# Altium schematic sheet LED_Board.SchDoc
size B
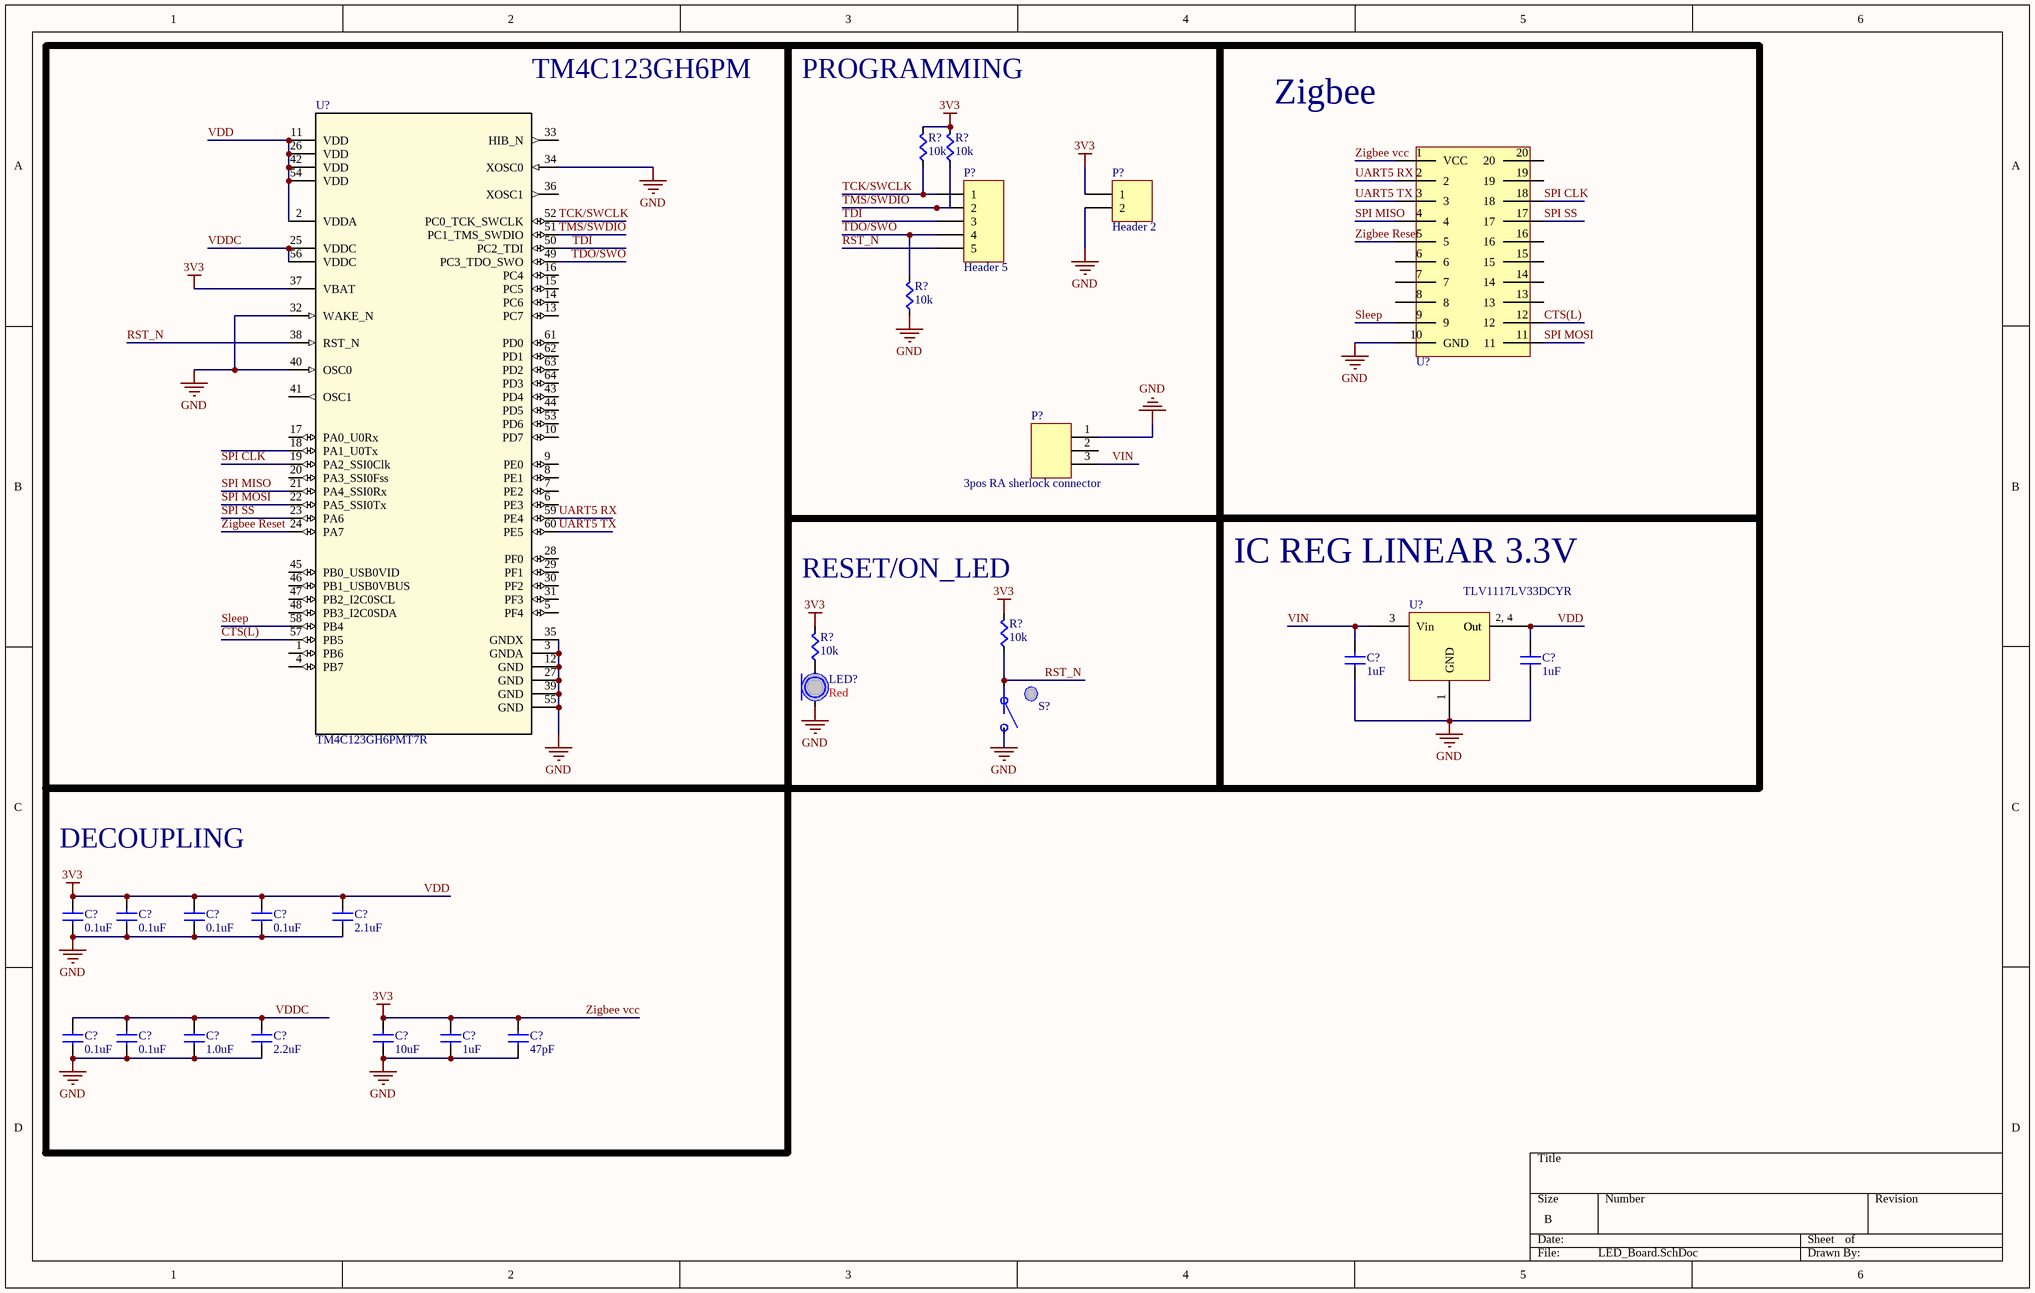
[diagram p0: LED_Board.SchDoc]

## Parts
(Parts that share a designator on the sheet are numbered #1, #2 ... from top to bottom, then left to right.)
C?#1  value 1uF  [CAPC0603]  (hidden comment: Cap)
C?#2  value 1uF  [CAPC0603]  (hidden comment: Cap)
C?#3  value 0.1uF  [CAPC0603]  (hidden comment: Cap)
C?#4  value 0.1uF  [CAPC0603]  (hidden comment: Cap)
C?#5  value 0.1uF  [CAPC0603]  (hidden comment: Cap)
C?#6  value 0.1uF  [CAPC0603]  (hidden comment: Cap)
C?#7  value 2.1uF  [CAPC0603]  (hidden comment: Cap)
C?#8  value 0.1uF  [CAPC0603]  (hidden comment: Cap)
C?#9  value 0.1uF  [CAPC0603]  (hidden comment: Cap)
C?#10  value 1.0uF  [CAPC0603]  (hidden comment: Cap)
C?#11  value 2.2uF  [CAPC0603]  (hidden comment: Cap)
C?#12  value 10uF  [CAPC0603]  (hidden comment: Cap)
C?#13  value 1uF  [CAPC0603]  (hidden comment: Cap)
C?#14  value 47pF  [CAPC0603]  (hidden comment: Cap)
LED?  Color: Red  [LED0603]  (hidden comment: LED)
P?#1  Header 5  [HDR1X5]
P?#2  Header 2  [HDR1X2]
P?#3  3pos RA sherlock connector  [MOLEX-HDR-1X3-SHERLOCK-RA]
R?#1  value 10k  [RES0603]  (hidden comment: Res)
R?#2  value 10k  [RES0603]  (hidden comment: Res)
R?#3  value 10k  [RES0603]  (hidden comment: Res)
R?#4  value 10k  [RES0603]  (hidden comment: Res)
R?#5  value 10k  [RES0603]  (hidden comment: Res)
S?  Button  [PTS645xxxxSMTR92]  (value not drawn)
U?#1  XBee  [XBee]  (value not drawn)
U?#2  TM4C123GH6PMT7R  [PM0064A_N]
U?#3  TLV1117LV33DCYR  [SOT23-4N]

## Blocks framed on the sheet
TM4C123GH6PM: U?#2
Zigbee: U?#1
IC REG LINEAR 3.3V: C?#1 C?#2 U?#3
DECOUPLING: C?#3-C?#14

## Nets
GND: C?#1.2(B) C?#2.2(B) C?#3.2(B) C?#4.2(B) C?#5.2(B) C?#6.2(B) C?#7.2(B) C?#8.2(B) C?#9.2(B) C?#10.2(B) C?#11.2(B) C?#12.2(B) C?#13.2(B) C?#14.2(B) LED?.C P?#2.2 P?#3.1 R?#3.2(B) S?.B U?#1.10(GND) U?#2.3(GNDA) U?#2.12(GND) U?#2.27(GND) U?#2.32(WAKE_N) U?#2.34(XOSC0) U?#2.35(GNDX) U?#2.39(GND) U?#2.40(OSC0) U?#2.55(GND) U?#3.1(GND)
VDD: C?#2.1(A) C?#3.1(A) C?#4.1(A) C?#5.1(A) C?#6.1(A) C?#7.1(A) C?#12.1(A) C?#13.1(A) C?#14.1(A) P?#2.1 R?#1.1(A) R?#2.1(A) R?#4.1(A) R?#5.1(A) U?#1.1(VCC) U?#2.2(VDDA) U?#2.11(VDD) U?#2.26(VDD) U?#2.37(VBAT) U?#2.42(VDD) U?#2.54(VDD) U?#3.2(Out) U?#3.4(Out)  [also labelled 3V3, Zigbee vcc]
CTS(L): U?#1.12 U?#2.57(PB5)
RST_N: P?#1.5 R?#4.2(B) S?.A U?#2.38(RST_N)
Sleep: U?#1.9 U?#2.58(PB4)
SPI CLK: U?#1.18 U?#2.19(PA2_SSI0Clk)
SPI MISO: U?#1.4 U?#2.21(PA4_SSI0Rx)
SPI MOSI: U?#1.11 U?#2.22(PA5_SSI0Tx)
SPI SS: U?#1.17 U?#2.23(PA6)
TCK/SWCLK: P?#1.1 R?#1.2(B) U?#2.52(PC0_TCK_SWCLK)
TDI: P?#1.3 U?#2.50(PC2_TDI)
TDO/SWO: P?#1.4 R?#3.1(A) U?#2.49(PC3_TDO_SWO)
TMS/SWDIO: P?#1.2 R?#2.2(B) U?#2.51(PC1_TMS_SWDIO)
UART5 RX: U?#1.2 U?#2.59(PE4)
UART5 TX: U?#1.3 U?#2.60(PE5)
VDDC: C?#8.1(A) C?#9.1(A) C?#10.1(A) C?#11.1(A) U?#2.25(VDDC) U?#2.56(VDDC)
VIN: C?#1.1(A) P?#3.3 U?#3.3(Vin)
Zigbee Reset: U?#1.5 U?#2.24(PA7)
NetLED?_A: LED?.A R?#5.2(B)

Not connected (* = marked no-connect by the designer): P?#3 2; U?#1 6 7 8 13 14 15 16 19 20; U?#2 1(PB6) 4(PB7) 5(PF4) 6(PE3) 7(PE2) 8(PE1) 9(PE0) 10(PD7) 13(PC7) 14(PC6) 15(PC5) 16(PC4) 17(PA0_U0Rx) 18(PA1_U0Tx) 20(PA3_SSI0Fss) 28(PF0) 29(PF1) 30(PF2) 31(PF3) 33(HIB_N) 36(XOSC1) 41(OSC1) 43(PD4) 44(PD5) 45(PB0_USB0VID) 46(PB1_USB0VBUS) 47(PB2_I2C0SCL) 48(PB3_I2C0SDA) 53(PD6) 61(PD0) 62(PD1) 63(PD2) 64(PD3)

## Notes on the sheet
- (near R?#1) PROGRAMMING
- (near R?#4) RESET/ON_LED
- (in symbol TLV1117LV33DCYR) 2, 4

## Library data of the parts
C?#1 C?#2 = Cap: Manufacturer Part Number: C0603C105K8PACTU; Supplier 1: Digi-Key; Supplier Part Number 1: 399-3118-1-ND
P?#1 = Header 5: Header, 5-Pin; LatestRevisionDate: 17-Jul-2002; LatestRevisionNote: Re-released for DXP Platform.; Publisher: Altium Limited
P?#2 = Header 2: Header, 2-Pin; LatestRevisionDate: 17-Jul-2002; LatestRevisionNote: Re-released for DXP Platform.; Publisher: Altium Limited
P?#3 = MOLEX-HDR-1x3-SHERLOCK_RA: Header, Molex, 2mm Pitch Sherlock Header, Single Row, Right Angle 3 Circuits, Length 3.3mm; Manufacturer Part Number: 35363-0360; Manufacturer: Molex Connector Corporation; Supplier Part Number 1: WM18932-ND; Supplier 1: Digi-Key
S? = Button: SPST Button; Supplier 1: Digi-Key; Supplier Part Number 1: CKN9087CT-ND
U?#1 = XBee: XBee radio; Supplier 1: Digi-Key; Supplier Part Number 1: 602-1181-ND
U?#2 = TM4C123GH6PMT7R: Imported; PartNumber: TM4C123GH6PMTR; Manufacturer: Texas Instruments; CompType: IC; PIN_COUNT: 64; Application_BuildNumber: *; Alternate_PartNumber: TM4C123GH6PMT; PackageReference: PM0064A; MountType: SMT; RoHS: Y; RefDes: RefDes; TYPE: TYPE; Value: Value
U?#3 = TLV1117LV33DCYR: IC REG LINEAR 3.3V 1A SOT223-4; Digi-Key Part Number: 296-28778-1-ND
C?#3-C?#14 = Cap: Supplier 1: Digi-Key; Supplier Part Number 1: 1276-1000-1-ND
LED? = LED: Supplier 1: Digi-Key; Supplier Part Number 1: 754-1122-1-ND
R?#1-R?#5 = Res: Supplier 1: Digi-Key; Supplier Part Number 1: RMCF0603JT10K0CT-ND